# Altium schematic sheet LCL Atari Punk V2.SchDoc: LCL ATARI PUNK CONSOLE
size A4; Address1: ludzinc.blogspot.com.au; Address3: www.lowcostlabs.com.au; DocumentNumber: LCL_007; Revision: V2.1; SheetNumber: 1; SheetTotal: 1
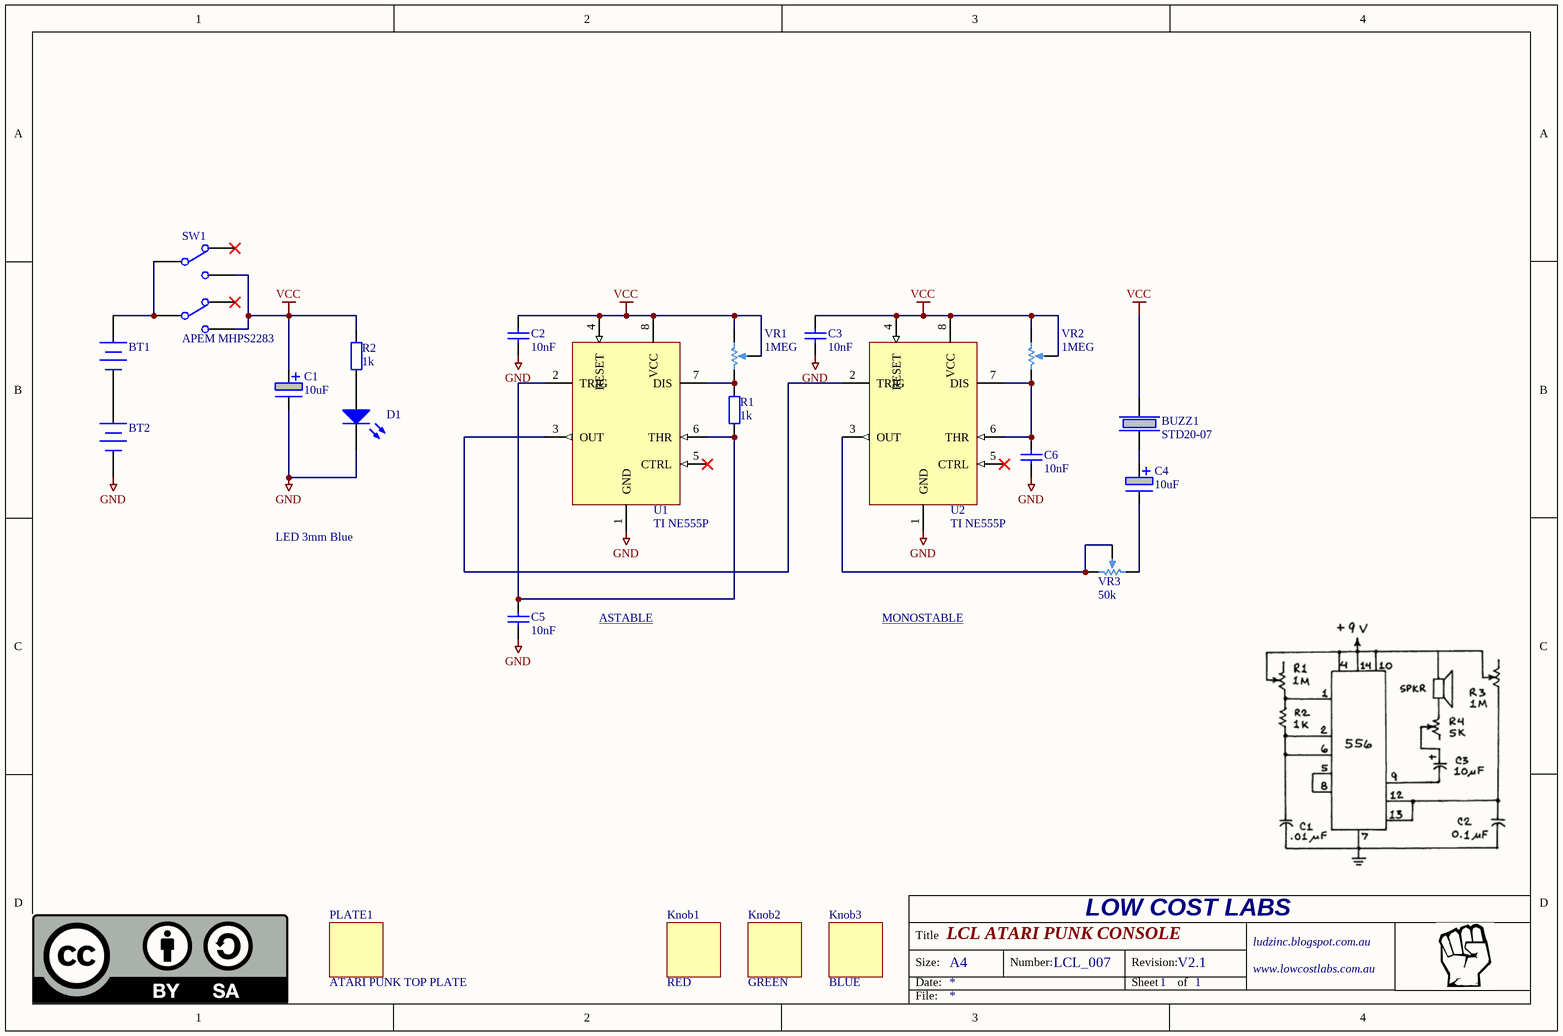
[diagram p0: LCL Atari Punk V2.SchDoc]

## Parts
BT1  CR2032 Battery Holder  [PCB-dvcba8mzfnv4aqscf1uc-1]  (value not drawn)
BT2  CR2032 Battery Holder  [PCB-dvcba8mzfnv4aqscf1uc-1]  (value not drawn)
BUZZ1  STD20-07  [PCB-fy5tm47je2z5a6wt53fs-1]
C1  10uF  [PCB-ekxurobr9mz5kbw5d2ks-1]
C2  10nF  [PCB-5q3b1ntq00bqadu474q8-1]
C3  10nF  [PCB-5q3b1ntq00bqadu474q8-1]
C4  10uF  [PCB-ekxurobr9mz5kbw5d2ks-1]
C5  10nF  [PCB-5q3b1ntq00bqadu474q8-1]
C6  10nF  [PCB-5q3b1ntq00bqadu474q8-1]
D1  LED 3mm Blue  [PCB-6aozigmjsxd1tpg9bi5a-1]
Knob1  RED  [PCB-uiy5h88ywsirsj7o87r0-1]
Knob2  GREEN  [PCB-uiy5h88ywsirsj7o87r0-1]
Knob3  BLUE  [PCB-uiy5h88ywsirsj7o87r0-1]
PLATE1  ATARI PUNK TOP PLATE  [PCB-r61ct1i2zrjc296u1a17-1]
R1  1k  [PCB-ixiz65tg090k47x3fmi7-1]
R2  1k  [PCB-ixiz65tg090k47x3fmi7-1]
SW1  APEM MHPS2283  [PCB-3xh7x2auc3uid3bxc76z-1]
U1  TI NE555P  [DIP8-2.54-10.9X6.6MM]
U2  TI NE555P  [DIP8-2.54-10.9X6.6MM]
VR1  value 1MEG  [PCB-wc6scyizddradfuod10o-1]  (hidden comment: Res1)
VR2  value 1MEG  [PCB-wc6scyizddradfuod10o-1]  (hidden comment: Res1)
VR3  value 50k  [PCB-wc6scyizddradfuod10o-1]  (hidden comment: Res1)

## Nets
GND: BT2.2(-) C1.2 C2.1 C3.1 C5.1 C6.1 D1.2(K) U1.1(GND) U2.1(GND)
VCC: BUZZ1.1 C1.1 C2.2 C3.2 R2.2 SW1.2(NC1) SW1.5(NC2) U1.4(RESET) U1.8(VCC) U2.4(RESET) U2.8(VCC) VR1.1(TOP) VR1.2(TAP) VR2.1(TOP) VR2.2(TAP)
NetBT1_1: BT1.1(+) SW1.1(NO1) SW1.6(NO2)
NetBT1_2: BT1.2(-) BT2.1(+)
NetBUZZ1_2: BUZZ1.2 C4.1
NetC4_2: C4.2 VR3.3(BOT)
NetC5_2: C5.2 R1.1 U1.2(TRIG) U1.6(THR)
NetC6_2: C6.2 U2.6(THR) U2.7(DIS) VR2.3(BOT)
NetD1_1: D1.1(A) R2.1
NetR1_2: R1.2 U1.7(DIS) VR1.3(BOT)
NetU1_3: U1.3(OUT) U2.2(TRIG)
NetU2_3: U2.3(OUT) VR3.1(TOP) VR3.2(TAP)

Not connected (* = marked no-connect by the designer): SW1 3(COM1)* 4(COM2)*; U1 5(CTRL)*; U2 5(CTRL)*

## Notes on the sheet
- ASTABLE
- MONOSTABLE
- LOW COST LABS
- Title
- Size:
- Date:
- A4
- Number:
- Revision:
- Sheet
- of
- File:

## Library data of the parts
BT1 BT2 = CMP-dvcba8mzfnv4aqscf1uc-2: CR2032 Battery Holder, Through Hole, Horizontal Mount; CustomComponentID: dvcba8mzfnv4aqscf1uc
BUZZ1 = CMP-pmjr7gi2f8i0k2q0oml6-1: BUZZER STD20-07 (EFM2060) PIEZO PASSIVE BUZZER; CustomComponentID: pmjr7gi2f8i0k2q0oml6
C1 C4 = CMP-su2zmkw1kc3z49ns9isd-1: 5mm Through Hole Electrolytic 2mm Pitch, 5mm height; CustomComponentID: su2zmkw1kc3z49ns9isd
C2 C3 C5 C6 = CMP-f9eb30fd1b76262c-1: Capacitor, Ceramic, 10000pF, 50VDC, 20-% Tol, 20+% Tol, X7R-TC Code, -15, 15%-TC; Manufacturer Part Number: C315C103M5R5TA; Octopart URL: http://octopart.com/c315c103m5r5ta-kemet-1886203; RoHS: Compliant; Mounting Style: Through Hole; OctopartID: f9eb30fd1b76262c
D1 = CMP-tzej1yqmv3j3170hmi0g-1: 3mm Blue Through Hole LED; CustomComponentID: tzej1yqmv3j3170hmi0g
Knob1-Knob3 = CMP-8ktywbehqx0aixue8nez-1: Pot Knob; CustomComponentID: 8ktywbehqx0aixue8nez
PLATE1 = CMP-m1ejk5tgbv5wzvnlhkp4-6: ATARI PUNK TOP PLATE ASSEMBLY WITH 10mm STANDOFFS AND SCREWS; CustomComponentID: m1ejk5tgbv5wzvnlhkp4
R1 R2 = CMP-iaxfckaaxq3jb0c9euu5-1: RESISITOR THROUGH HOLE 1/4W; CustomComponentID: iaxfckaaxq3jb0c9euu5
SW1 = CMP-64d5adcf469dbb12-6: Switch Key DPDT 0.1A 30VDC 1.76N PC Pins Thru-Hole; Contacts Type: DPDT; Contact Plating: Silver; RoHS: Compliant
U1 U2 = CMP-8f734534f03350b4-2: Peripheral circuit; astable/monostable, timer; 10 V; 500kHz; DIP8; Current Rating: 10.0 A; Frequency: 500000.0 Hz; Lead-Free Status: Lead Free; Quiescent Current: 0.002 A; Lifecycle Status: Active; Octopart Url: http://octopart.com/ne555p-texas+instruments-55400998; RoHS: Compliant; Mounting Style: Through Hole; Packaging: Tube; Case/Package: DIP; Seller Landing  Url: https://octopart-clicks.com/click/track?country=US&ak=8157f166&sig=0d0d011&sid=5489&ppid=55400998&vpid=190514176&ct=offers; Manufacturer Part Number: NE555P; OctopartID: 8f734534f03350b4; REACH SVHC Compliance: No SVHC; Number of Pins: 8
VR1-VR3 = CMP-9d2d547574b442ea-5: P090 Series 9 mm Top Adjustment 10 kOhm ±20 % Shaft Rotary Potentiometer; Manufacturer Part Number: P090S-14T20BR10K; Power Rating: 30.0 mW; Resistance Tolerance: ±20%; Lead-Free Status: Lead Free; OctopartID: 9d2d547574b442ea; Octopart URL: http://octopart.com/p090s-14t20br10k-bi+technologies-5426431; RoHS: Compliant